# Altium schematic sheet Zoul.SchDoc: RF COMMUNICATION MODULE
size A; DrawnBy: Diego Gomez Canales; DocumentNumber: SCH-3; Revision: 1.0; SheetNumber: 3; SheetTotal: 4
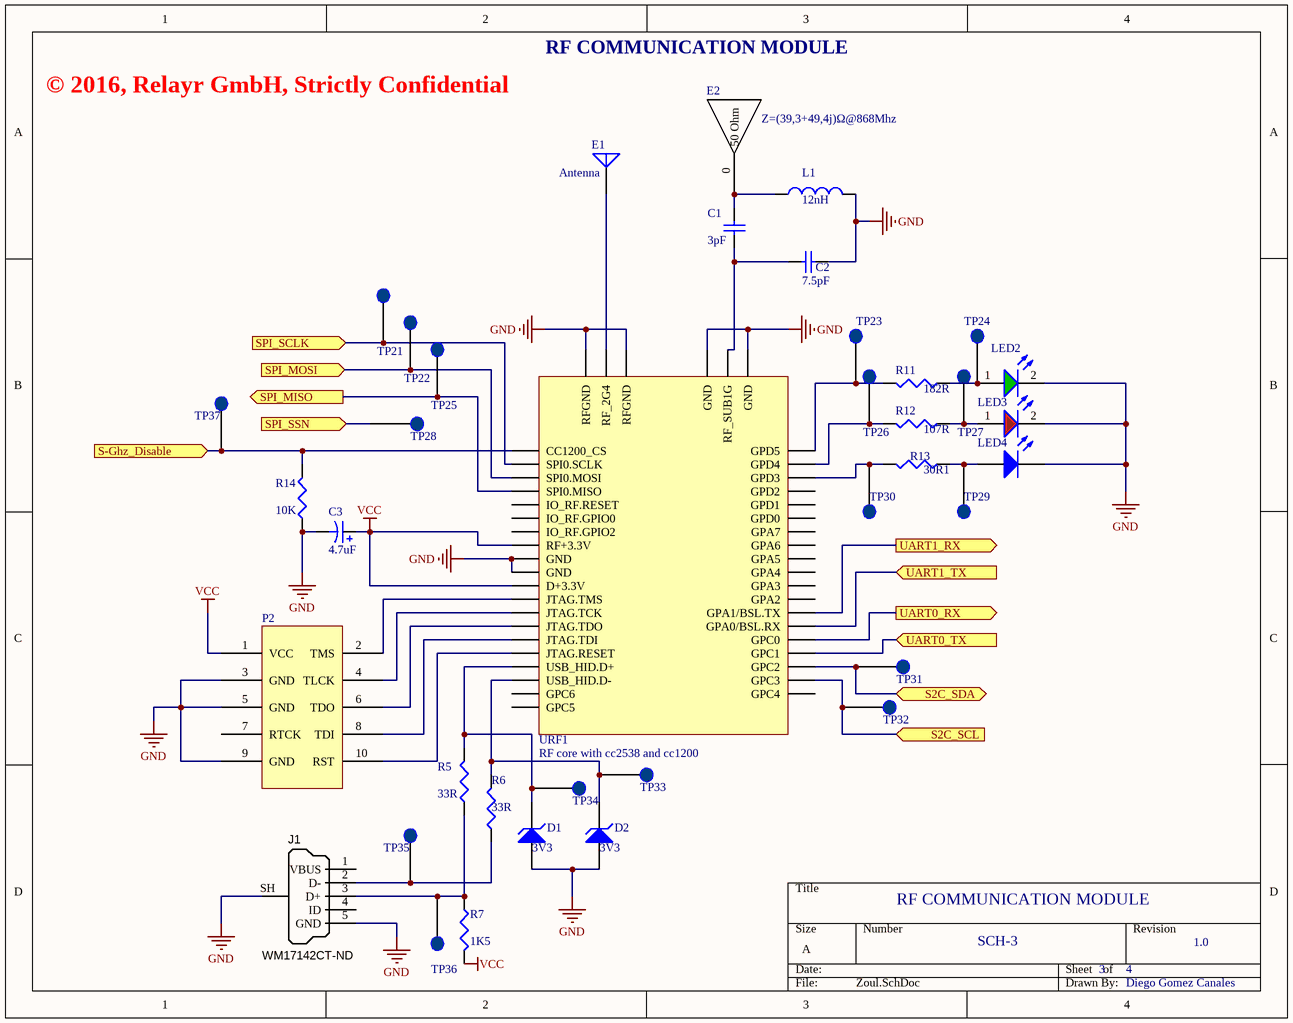
[diagram p0: Zoul.SchDoc]

## Parts
C1  value 3pF  [6-0805_N]  (hidden comment: Cap)
C2  value 7.5pF  [6-0805_N]  (hidden comment: Cap)
C3  value 4.7uF  [C0805]  (hidden comment: Cap Pol3)
D1  3V3  [425]
D2  3V3  [425]
E1  Antenna  [INDC3216]
E2  Component_1  [DNO24]  (value not drawn)
J1  Supplier Part Number 1: WM17142CT-ND  [USB_Micro-B_Molex_SMD]  (hidden comment: USB Micro Type B)
L1  value 12nH  [6-0805_N]  (hidden comment: Inductor)
LED2  150080GS75000  [6-0805_N]  (value not drawn)
LED3  150080RS75000  [6-0805_N]  (value not drawn)
LED4  5988191107F  [6-0805_N]  (value not drawn)
P2  FTSH-105-01-L-DV-K  [JTAG]  (value not drawn)
R5  value 33R  [6-0805_N]  (hidden comment: Res3)
R6  value 33R  [6-0805_N]  (hidden comment: Res3)
R7  value 1K5  [6-0805_N]  (hidden comment: Res3)
R11  value 182R  [6-0805_N]  (hidden comment: Res3)
R12  value 107R  [6-0805_N]  (hidden comment: Res3)
R13  value 30R1  [6-0805_N]  (hidden comment: Res3)
R14  value 10K  [6-0805_N]  (hidden comment: Res3)
TP21  TEST_POINT  [TP]  (value not drawn)
TP22  TEST_POINT  [TP]  (value not drawn)
TP23  TEST_POINT  [TP]  (value not drawn)
TP24  TEST_POINT  [TP]  (value not drawn)
TP25  TEST_POINT  [TP]  (value not drawn)
TP26  TEST_POINT  [TP]  (value not drawn)
TP27  TEST_POINT  [TP]  (value not drawn)
TP28  TEST_POINT  [TP]  (value not drawn)
TP29  TEST_POINT  [TP]  (value not drawn)
TP30  TEST_POINT  [TP]  (value not drawn)
TP31  TEST_POINT  [TP]  (value not drawn)
TP32  TEST_POINT  [TP]  (value not drawn)
TP33  TEST_POINT  [TP]  (value not drawn)
TP34  TEST_POINT  [TP]  (value not drawn)
TP35  TEST_POINT  [TP]  (value not drawn)
TP36  TEST_POINT  [TP]  (value not drawn)
TP37  TEST_POINT  [TP]  (value not drawn)
URF1  RF core with cc2538 and cc1200  [ZOUL]

## Ports
S2C_SCL (in), S2C_SDA (bidir), S-Ghz_Disable (in), SPI_MISO (out), SPI_MOSI (in), SPI_SCLK (in), SPI_SSN (in), UART0_RX (out), UART0_TX (in), UART1_RX (out), UART1_TX (in)

## Nets
GND: C2.1 C3.2 D1.1(A) D2.1(A) J1.5(GND) J1.SH(Shell) L1.2 LED2.2(C) LED3.2(C) LED4.2(K) P2.3(GND) P2.5(GND) P2.9(GND) R14.1 URF1.9(GND) URF1.10(GND) URF1.40(GND) URF1.42(GND) URF1.43(RFGND) URF1.45(RFGND)
VCC: C3.1 P2.1(VCC) R7.2 URF1.8(RF+3.3V) URF1.11(D+3.3V)
S2C_SCL: TP32.1 URF1.22(GPC3) ; port S2C_SCL
S2C_SDA: TP31.1 URF1.23(GPC2) ; port S2C_SDA
S-Ghz_Disable: R14.2 TP37.1 URF1.1(CC1200_CS) ; port S-Ghz_Disable
SPI_MISO: TP25.1 URF1.4(SPI0.MISO) ; port SPI_MISO
SPI_MOSI: TP22.1 URF1.3(SPI0.MOSI) ; port SPI_MOSI
SPI_SCLK: TP21.1 URF1.2(SPI0.SCLK) ; port SPI_SCLK
SPI_SSN: TP28.1 ; port SPI_SSN
UART0_RX: URF1.25(GPC0) ; port UART0_RX
UART0_TX: URF1.24(GPC1) ; port UART0_TX
UART1_RX: URF1.27(GPA1/BSL.TX) ; port UART1_RX
UART1_TX: URF1.26(GPA0/BSL.RX) ; port UART1_TX
NetC1_1: C1.1 C2.2 URF1.41(RF_SUB1G)
NetC1_2: C1.2 E2.0(50_Ohm) L1.1
NetD1_2: D1.2(K) R5.2 TP34.1 URF1.17(USB_HID.D+)
NetD2_2: D2.2(K) R6.2 TP33.1 URF1.18(USB_HID.D-)
NetE1_1: E1.1(A) URF1.44(RF_2G4)
NetJ1_2: J1.2(D-) R6.1 TP35.1
NetJ1_3: J1.3(D+) R5.1 R7.1 TP36.1
NetLED2_1: LED2.1(A) R11.1 TP24.1
NetLED3_1: LED3.1(A) R12.1 TP27.1
NetLED4_1: LED4.1(A) R13.1 TP29.1
NetP2_2: P2.2(TMS) URF1.12(JTAG.TMS)
NetP2_4: P2.4(TLCK) URF1.13(JTAG.TCK)
NetP2_6: P2.6(TDO) URF1.14(JTAG.TDO)
NetP2_8: P2.8(TDI) URF1.15(JTAG.TDI)
NetP2_10: P2.10(RST) URF1.16(JTAG.RESET)
NetR11_2: R11.2 TP23.1 URF1.39(GPD5)
NetR12_2: R12.2 TP26.1 URF1.38(GPD4)
NetR13_2: R13.2 TP30.1 URF1.37(GPD3)

Not connected (* = marked no-connect by the designer): J1 1(VBUS) 4(ID); P2 7(RTCK); URF1 5(IO_RF.RESET) 6(IO_RF.GPIO0) 7(IO_RF.GPIO2) 19(GPC6) 20(GPC5) 21(GPC4) 28(GPA2) 29(GPA3) 30(GPA4) 31(GPA5) 32(GPA6) 33(GPA7) 34(GPD0) 35(GPD1) 36(GPD2)

## Notes on the sheet
- © 2016, Relayr GmbH, Strictly Confidential
- RF COMMUNICATION MODULE
- (near E2) Z=(39,3+49,4j)Ω@868Mhz

## Library data of the parts
C1 C2 = Cap: Capacitor; Published: 8-Jun-2000; LatestRevisionDate: 17-Jul-2002; LatestRevisionNote: Re-released for DXP Platform.; PackageReference: RAD-0.3; Publisher: Altium Limited; PackageDescription: Radial Cap, Thru-Hole; 2 Leads; 0.3 in Pin Spacing; Supplier 1: Digi-Key
  C1: Supplier Part Number 1: 1276-2550-2-ND
  C2: Supplier Part Number 1: 712-1374-2-ND
C3 = Cap Pol3: Polarized Capacitor (Surface Mount); Published: 8-Jun-2000; LatestRevisionDate: 29-May-2009; LatestRevisionNote: IPC-7351 Footprint Added.; PackageReference: C0805; Publisher: Altium Limited; PackageDescription: Chip Capacitor; Supplier 1: Digi-Key; Supplier Part Number 1: 490-3335-2-ND
D1 D2 = D Zener: Zener Diode; Published: 8-Jun-2000; LatestRevisionDate: 17-Jul-2002; LatestRevisionNote: Re-released for DXP Platform.; PackageReference: DIODE-0.7; Publisher: Altium Limited; PackageDescription: Diode, Thru-Hole; 2 Leads; 0.7 in Pin Spacing; Supplier 1: Digi-Key; Supplier Part Number 1: DZ2J03300LTR-ND
E1 = Antenna: Generic Antenna; Published: 24-Mar-1999; LatestRevisionDate: 17-Jul-2002; LatestRevisionNote: Re-released for DXP Platform.; PackageReference: PIN1; Publisher: Altium Limited; Supplier 1: Digi-Key; Supplier Part Number 1: 712-1005-2-ND
E2 = Component_1: Antenna SubGhz PCB
J1 = USB_Micro_TypeB_1: Connector SMD USB Micro Type B middle mount; Manufacturer 1: Molex Inc; Manufacturer Part Number 1: 47491-0001; SCDType: undef; Package / Case: SMD; Supplier 1: Digi-Key
L1 = Inductor: Code_IEC: 1005; Published: 8-Jun-2000; LatestRevisionDate: 29-May-2009; LatestRevisionNote: IPC-7351 Footprint Added.; PackageReference: 0402-A; Publisher: Altium Limited; PackageDescription: Chip Inductor; Code_JEITA: 0402; Supplier 1: Digi-Key; Supplier Part Number 1: 535-11555-2-ND
LED2 = WL-SMCW 0805  150080GS75000: SMD mono-color Chip LED, WL-SMCW, Green; Manufacturer: W黵th Elektronik eiSos GmbH; PartNo: 150080GS75000; ComponentLink1Description: Manufacturer; ComponentLink1URL: http://www.we-online.de; Created by: Christin Otto; Created Date: June 2013; ComponentLink2Description: Datasheet; ComponentLink2URL: http://katalog.we-online.com/led/datasheet/150080GS75000.pdf; Color: Green; Supplier 1: Digi-Key; Supplier Part Number 1: 732-4983-1-ND
LED3 = WL-SMCW 0805  150080RS75000: SMD mono-color Chip LED, WL-SMCW, Red; Manufacturer: W黵th Elektronik eiSos GmbH; PartNo: 150080RS75000; ComponentLink1Description: Manufacturer; ComponentLink1URL: http://www.we-online.de; Created by: Christin Otto; Created Date: June 2013; ComponentLink2Description: Datasheet; ComponentLink2URL: http://katalog.we-online.com/led/datasheet/150080RS75000.pdf; Color: Red; Supplier 1: Digi-Key; Supplier Part Number 1: 732-4984-1-ND
LED4 = LED0: Blue 473nm LED Indication - Discrete 3.2V 0805 (2012 Metric); Published: 8-Jun-2000; LatestRevisionDate: 08-Jul-2005; LatestRevisionNote: Mech Layer 1 removed.; PackageReference: LED-0; Publisher: Altium Limited; PackageDescription: LED; 2 Leads; Supplier 1: Digi-Key; Supplier Part Number 1: 350-2046-1-ND
P2 = Component_1: Supplier 1: Digi-Key; Supplier Part Number 1: SAM8799-ND
R5-R7 R11-R14 = Res3: Resistor; Published: 8-Jun-2000; LatestRevisionDate: 29-May-2009; LatestRevisionNote: IPC-7351 Footprint Added.; PackageReference: J1-0603; Publisher: Altium Limited; PackageDescription: Chip Resistor; Supplier 1: Digi-Key
  R5 R6: Supplier Part Number 1: RPC0805JT33R0CT-ND
  R7: Supplier Part Number 1: RNCP0805FTD1K50TR-ND
  R11: Supplier Part Number 1: A110472CT-ND
  R12: Supplier Part Number 1: A110450CT-ND
  R13: Supplier Part Number 1: A110397CT-ND
  R14: Supplier Part Number 1: RPC0805JT10K0CT-ND
TP21-TP37 = TEST_POINT: Point of test to manufacturing
URF1 = ZOUL: Supplied By: Zolertia